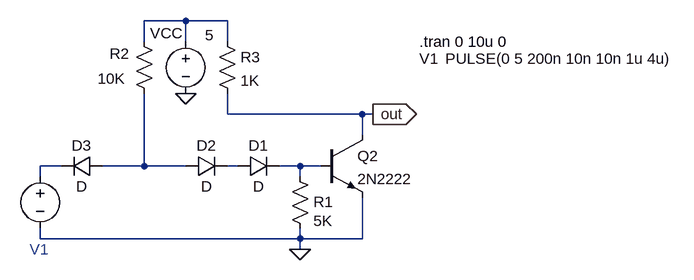
[diagram p0: schematic inverter_rtl_improved.asc]
inverter_rtl_improved.asc, the LTspice schematic file:
Version 4.1
SHEET 1 1124 680
WIRE 256 -80 192 -80
WIRE 320 -80 256 -80
WIRE 192 -48 192 -80
WIRE 256 -48 256 -80
WIRE 320 -48 320 -80
WIRE 320 64 320 32
WIRE 528 64 320 64
WIRE 544 64 528 64
WIRE 528 96 528 64
WIRE 64 144 32 144
WIRE 192 144 192 32
WIRE 192 144 128 144
WIRE 256 144 192 144
WIRE 336 144 320 144
WIRE 432 144 400 144
WIRE 464 144 432 144
WIRE 32 160 32 144
WIRE 432 160 432 144
WIRE 32 256 32 240
WIRE 432 256 432 240
WIRE 432 256 32 256
WIRE 528 256 528 192
WIRE 528 256 432 256
WIRE 432 272 432 256
FLAG 256 32 0
FLAG 544 64 out
IOPIN 544 64 Out
FLAG 432 272 0
SYMBOL voltage 32 144 R0
WINDOW 0 584 -166 Left 2
WINDOW 3 624 -166 Left 2
WINDOW 123 0 0 Left 0
WINDOW 39 0 0 Left 0
SYMATTR InstName V1
SYMATTR Value PULSE(0 5 200n 10n 10n 1u 4u)
SYMBOL npn 464 96 R0
SYMATTR InstName Q2
SYMATTR Value 2N2222
SYMBOL res 304 -64 R0
SYMATTR InstName R3
SYMATTR Value 1K
SYMBOL voltage 256 -64 R0
WINDOW 0 -55 3 Left 2
WINDOW 3 30 6 Left 2
SYMATTR InstName VCC
SYMATTR Value 5
SYMBOL res 416 144 R0
WINDOW 0 37 55 Left 2
WINDOW 3 37 84 Left 2
SYMATTR InstName R1
SYMATTR Value 5K
SYMBOL diode 336 160 R270
WINDOW 0 32 32 VTop 2
WINDOW 3 0 32 VBottom 2
SYMATTR InstName D1
SYMBOL diode 256 160 R270
WINDOW 0 32 32 VTop 2
WINDOW 3 0 32 VBottom 2
SYMATTR InstName D2
SYMBOL res 176 -64 R0
WINDOW 0 -37 35 Left 2
WINDOW 3 -56 73 Left 2
SYMATTR InstName R2
SYMATTR Value 10K
SYMBOL diode 128 128 R90
WINDOW 0 0 32 VBottom 2
WINDOW 3 32 32 VTop 2
SYMATTR InstName D3
TEXT 616 -48 Left 2 !.tran 0 10u 0
TEXT 16 272 Left 2 ;V1

The netlist it stands for:
* inverter_rtl_improved.asc
V1 N002 0 PULSE(0 5 200n 10n 10n 1u 4u)
Q2 out N005 0 0 2N2222
R3 N001 out 1K
VCC N001 0 5
R1 N005 0 5K
D1 N004 N005 D
D2 N003 N004 D
R2 N001 N003 10K
D3 N003 N002 D
.model D D
.lib standard.dio
.model NPN NPN
.model PNP PNP
.lib standard.bjt
.tran 0 10u 0
* V1
.backanno
.end